# EasyEDA Pro project Flags_Register.eprj

# Schematic Schematic1
Board Name: Board1; Create Date: 2025-08-16; Page Name: P1; Project Name: Flags_Register; Schematic Name: Schematic1; Update Date: 2025-08-16; Company: EasyEDA.com; Page Size: A4; Version: V1.0
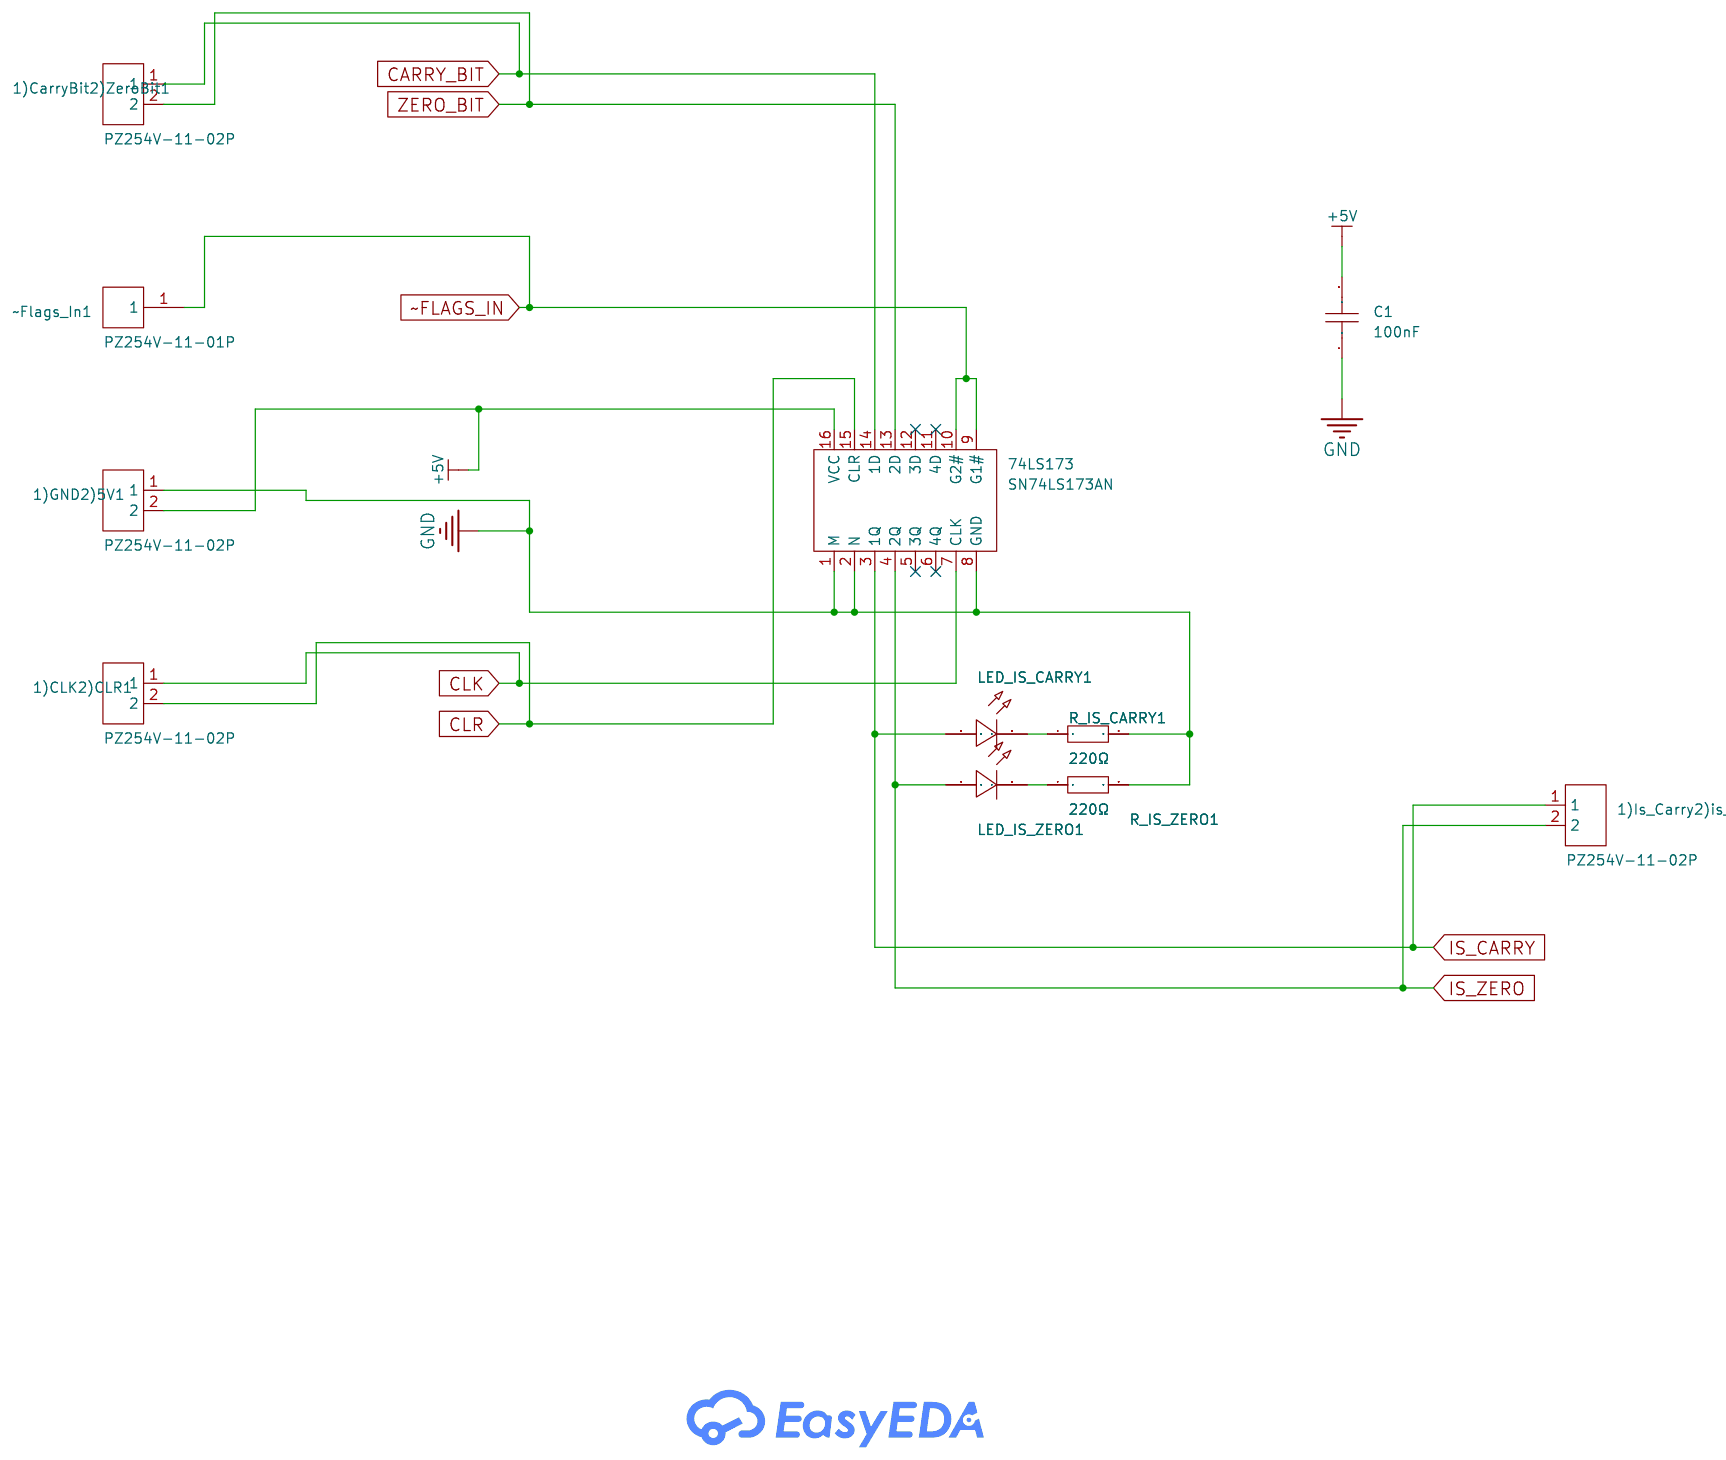
[diagram p0: schematic sheet]

## Parts
1)CarryBit2)ZeroBit1  PZ254V-11-02P  [HDR-TH_2P-P2.54-V-M]
1)CLK2)CLR1  PZ254V-11-02P  [HDR-TH_2P-P2.54-V-M]
1)GND2)5V1  PZ254V-11-02P  [HDR-TH_2P-P2.54-V-M]
1)Is_Carry2)is_Zero1  PZ254V-11-02P  [HDR-TH_2P-P2.54-V-M]
74LS173  SN74LS173AN  [PDIP-16_L19.3-W6.4-P2.54-LS7.94-BL]
C1  100nF  [CAP-TH_L8.5-W5.0-P5.00-D1.2]
LED_IS_CARRY1  -  [LED-TH_BD5.8-P2.54-FD]
LED_IS_ZERO1  -  [LED-TH_BD5.8-P2.54-FD]
R_IS_CARRY1  220Ω  [R_AXIAL-0.4]
R_IS_ZERO1  220Ω  [R_AXIAL-0.4]
~Flags_In1  PZ254V-11-01P  [HDR-TH_1P-P2.54-V-M]

## Library data of the parts
1)CarryBit2)ZeroBit1 1)CLK2)CLR1 1)GND2)5V1 1)Is_Carry2)is_Zero1 = PZ254V-11-02P: Pin Structure:1x2P Pitch:2.54mm Row Spacing:- Circluar Pins/Square Pins:Policy Mounting Type:Straight Number of Rows:Single Row Number of Pins:2P Current Rating:- Voltage Rating (Max):- Length of Mating Pin:6mm Insulation Height:2.5mm Length of End Connec; LCSC Part Name: 1x2P 间距:2.54mm 方针 直插; Supplier Part: C492401; Manufacturer: XFCN(兴飞); Supplier Footprint: 插件,P=2.54mm; JLCPCB Part Class: Extended Part; Datasheet: https://atta.szlcsc.com/upload/public/pdf/source/20200309/C492401_A812433581A9B211A7FFA413ADDFF0E5.pdf; Supplier: LCSC; Pin Structure: 1x2P; Pitch: 2.54mm; Circluar Pins/Square Pins: Policy; Mounting Type: Straight; Number of Rows: Single Row; Number of Pins: 2P; Length of Mating Pin: 6mm; Insulation Height: 2.5mm; Length of End Connection Pin: 3mm; Contact Material: Brass; Operating Temperature: -40℃~+105℃; Color: Black
74LS173 = SN74LS173AN: Type:D-Type Trigger Type:Rising Edge Voltage - Supply:4.75V~5.25V Voltage - Supply:4.75V~5.25V Clock Frequency:50MHz Function:Reset Number of Elements:1 Number of Bits per Element:4 Output Type:- Propagation Delay:30ns@5V,45pF Series:74LS Series Current -; Supplier Part: C1550125; Manufacturer: TI(德州仪器); Supplier Footprint: PDIP-16; JLCPCB Part Class: Extended Part; Datasheet: https://www.ti.com/cn/lit/gpn/sn74ls173a; Supplier: LCSC; Type: D-Type; Trigger Type: Rising Edge; Voltage - Supply: 4.75V~5.25V; Clock Frequency: 50MHz; Function: Reset; Number of Elements: 1; Number of Bits per Element: 4; Propagation Delay: 30ns@5V,45pF; Series: 74LS Series; Current - Output Low(IOL): 24mA; Current - Output High(IOH): 2.6mA; Quiescent Current: 24mA; Operating Temperature: 0℃~+70℃
C1 = CT4-0805B104K500F3: Capacitance:100nF Tolerance:±10% Tolerance:±10% Voltage Rated: Temperature Coefficient:; LCSC Part Name: 100nF ±10% 50V C3型（直脚）; Supplier Part: C84772; Manufacturer: FH(风华); Supplier Footprint: 插件,P=5.08mm; JLCPCB Part Class: Extended Part; Datasheet: https://atta.szlcsc.com/upload/public/pdf/source/20190402/C385200_059806A6312B28FF1421A2413EB641E1.pdf; Supplier: LCSC; Tolerance: ±10%
LED_IS_CARRY1 LED_IS_ZERO1 = LED_TH-R_5mm: Supplier Footprint: Through
R_IS_CARRY1 R_IS_ZERO1 = Res_AXIAL-1/4W: Supplier Footprint: Through
~Flags_In1 = PZ254V-11-01P: Pin Structure:1x1P Pitch:2.54mm Row Spacing:- Circluar Pins/Square Pins:Policy Mounting Type:Straight Number of Rows:Single Row Number of Pins:1P Current Rating:- Voltage Rating (Max):- Length of Mating Pin:6mm Insulation Height:2.5mm Length of End Connec; LCSC Part Name: 1x1P 间距:2.54mm 方针 直插; Supplier Part: C492400; Manufacturer: XFCN(兴飞); Supplier Footprint: 插件,P=2.54mm; JLCPCB Part Class: Extended Part; Datasheet: https://atta.szlcsc.com/upload/public/pdf/source/20200309/C492400_46876A5B545F5AE6B8D4A09C46E276E8.pdf; Supplier: LCSC; Pin Structure: 1x1P; Pitch: 2.54mm; Circluar Pins/Square Pins: Policy; Mounting Type: Straight; Number of Rows: Single Row; Number of Pins: 1P; Length of Mating Pin: 6mm; Insulation Height: 2.5mm; Length of End Connection Pin: 3mm; Contact Material: Brass; Operating Temperature: -40℃~+105℃; Color: Black

## Nets
+5V: 1)GND2)5V1.2 74LS173.16(VCC) C1.2
GND: 1)GND2)5V1.1 74LS173.1(M) 74LS173.2(N) 74LS173.8(GND) C1.1 R_IS_CARRY1.2 R_IS_ZERO1.2
CARRY_BIT: 1)CarryBit2)ZeroBit1.1 74LS173.14(1D)
CLK: 1)CLK2)CLR1.1 74LS173.7(CLK)
CLR: 1)CLK2)CLR1.2 74LS173.15(CLR)
IS_CARRY: 1)Is_Carry2)is_Zero1.1 74LS173.3(1Q) LED_IS_CARRY1.1(C)
IS_ZERO: 1)Is_Carry2)is_Zero1.2 74LS173.4(2Q) LED_IS_ZERO1.1(C)
ZERO_BIT: 1)CarryBit2)ZeroBit1.2 74LS173.13(2D)
~FLAGS_IN: 74LS173.9(G1#) 74LS173.10(G2#) ~Flags_In1.1
Net-(LED_IS_CARRY1-2): LED_IS_CARRY1.2(A) R_IS_CARRY1.1
Net-(LED_IS_ZERO1-2): LED_IS_ZERO1.2(A) R_IS_ZERO1.1

Not connected (* = marked no-connect by the designer): 74LS173 5(3Q)* 6(4Q)* 11(4D)* 12(3D)*

# Board PCB1
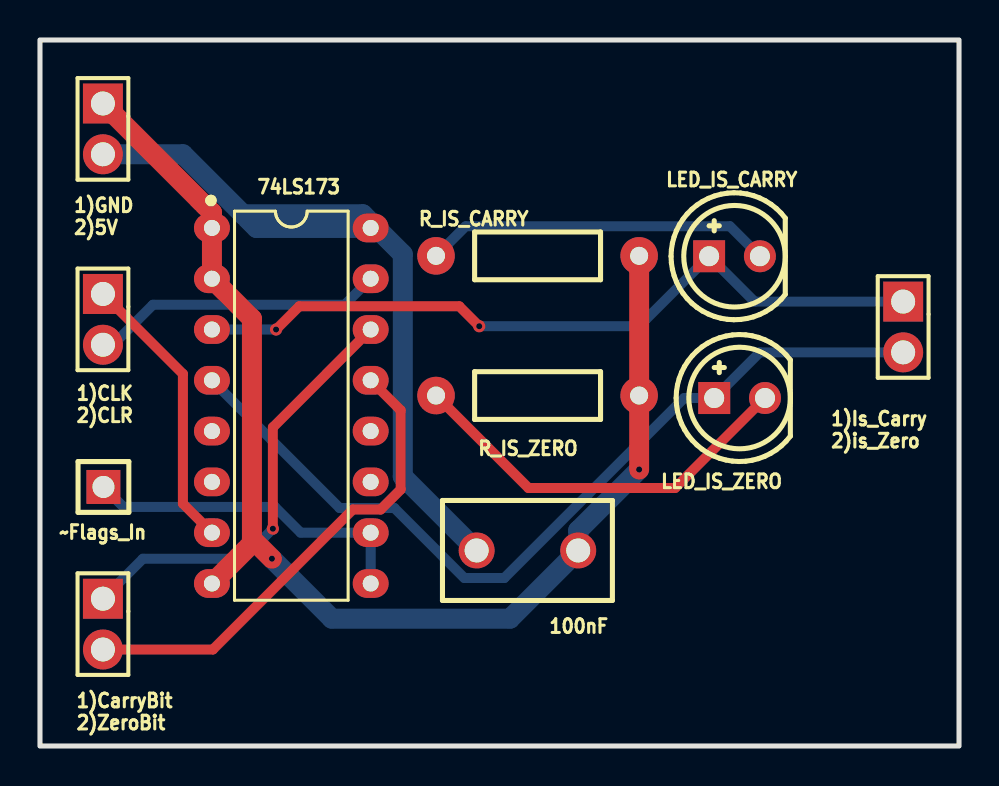
[diagram p1: board, top side]
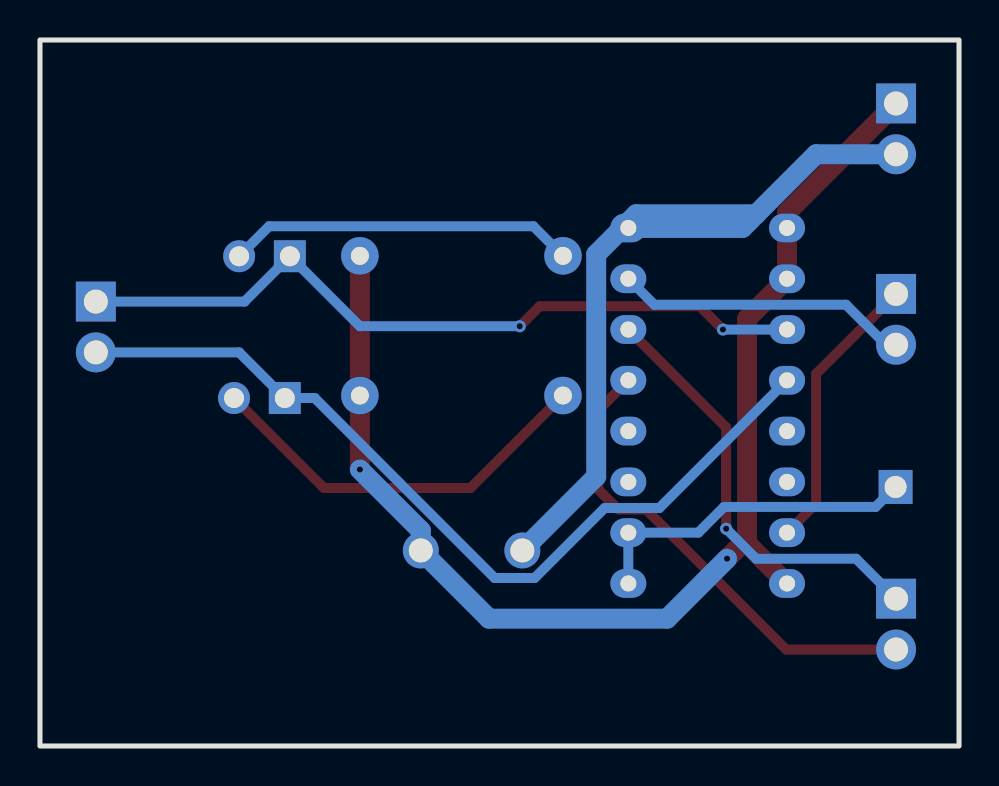
[diagram p2: board, bottom side, seen from below]

Outline 45.97 x 35.31 mm; copper layers: Top Layer, Bottom Layer. Coordinates in mm from the lower left corner of the outline.
Outline path: rectangle 0,35.31 45.97,0
Stack: Top Layer 0.035mm / Dielectric1 1.51mm FR4 er 4.5 / Bottom Layer 0.035mm

## Design rules (mm)
template: Custom Config
spacing copperThickness1oz (default): track to track 0.102, other pairs 0.152 to 0.3
spacing copperThickness2oz: track to track 0.203, other pairs 0.152 to 0.3
track width copperThickness1oz (default): min 0.127, default 0.5, max 2.54
track width copperThickness2oz: min 0.203, default 1, max 2.54
differential pair differentialPair (default): width min 0.127, default 0.254, max 2.54; gap min 0.152, default 0.152
via viaSize (default): diameter min 0.5, default 0.61, max 10; hole min 0.3, default 0.305, max 6.3
net GND uses copperThickness2oz
net +5V uses copperThickness2oz

## Placement (name value [footprint] x y rotation side)
1)CarryBit
2)ZeroBit  -  [HDR-TH_2P-P2.54-V-M]  3.15 6.1 270 top
1)CLK
2)CLR  -  [HDR-TH_2P-P2.54-V-M]  3.15 21.34 270 top
1)GND
2)5V  -  [HDR-TH_2P-P2.54-V-M]  3.15 30.86 270 top
1)Is_Carry
2)is_Zero  -  [HDR-TH_2P-P2.54-V-M]  43.18 20.95 270 top
74LS173  SN74LS173AN  [PDIP-16_L19.3-W6.4-P2.54-LS7.94-BL]  12.57 17.02 270 top
100nF  -  [CAP-TH_L8.5-W5.0-P5.00-D1.2]  24.38 9.78 180 top
LED_IS_CARRY  -  [LED-TH_BD5.8-P2.54-FD]  34.74 24.49 0 top
LED_IS_ZERO  -  [LED-TH_BD5.8-P2.54-FD]  35 17.4 0 top
R_IS_CARRY  -  [R_AXIAL-0.4]  24.89 24.51 0 top
R_IS_ZERO  -  [R_AXIAL-0.4]  24.89 17.53 0 top
~Flags_In  -  [HDR-TH_1P-P2.54-V-M]  3.18 12.95 0 top

## Footprints (pads in the part's own frame, mm; a bottom-side part is the same pattern mirrored in y, then rotated)
CAP-TH_L8.5-W5.0-P5.00-D1.2
  round 1.8 hole 1.2: 1(-2.54,0) 2(2.54,0)
HDR-TH_1P-P2.54-V-M
  rect 1.7x1.7 hole 1.1: 1(0,0)
HDR-TH_2P-P2.54-V-M
  rect 2x2 hole 1.2: 1(-1.27,0)
  round 2 hole 1.2: 2(1.27,0)
LED-TH_BD5.8-P2.54-FD
  rect 1.6x1.6 hole 1: 1(-1.27,0)
  round 1.6 hole 1: 2(1.27,0)
PDIP-16_L19.3-W6.4-P2.54-LS7.94-BL
  oval 1.44x1.8 hole 0.8: 1(-8.89,-3.97) 2(-6.35,-3.97) 3(-3.81,-3.97) 4(-1.27,-3.97) 5(1.27,-3.97) 6(3.81,-3.97) 7(6.35,-3.97) 8(8.89,-3.97) 9(8.89,3.97) 10(6.35,3.97) 11(3.81,3.97) 12(1.27,3.97) 13(-1.27,3.97) 14(-3.81,3.97) 15(-6.35,3.97) 16(-8.89,3.97)
R_AXIAL-0.4
  round 1.879 hole 0.899: 1(-5.08,0) 2(5.08,0)

## Nets
+5V: 1)GND
2)5V.2 74LS173.16 100nF.2
GND: 1)GND
2)5V.1 74LS173.1 74LS173.2 74LS173.8 100nF.1 R_IS_CARRY.2 R_IS_ZERO.2
CARRY_BIT: 1)CarryBit
2)ZeroBit.1 74LS173.14
CLK: 1)CLK
2)CLR.1 74LS173.7
CLR: 1)CLK
2)CLR.2 74LS173.15
IS_CARRY: 1)Is_Carry
2)is_Zero.1 74LS173.3 LED_IS_CARRY.1
IS_ZERO: 1)Is_Carry
2)is_Zero.2 74LS173.4 LED_IS_ZERO.1
ZERO_BIT: 1)CarryBit
2)ZeroBit.2 74LS173.13
~FLAGS_IN: 74LS173.9 74LS173.10 ~Flags_In.1
$1N628: LED_IS_CARRY.2 R_IS_CARRY.1
$1N629: LED_IS_ZERO.2 R_IS_ZERO.1

Pads without a net: 74LS173 5 6 11 12

## Via types
v1: diameter 0.61, hole 0.305, Top Layer to Bottom Layer, 5 vias

## Routing (per net, layer and track width the routed paths; a pad name or vN(x,y) marks a point on that pad's centre or on a via; arc(x,y) is an arc through that point)
+5V: length 40.1
  Bottom Layer w1: 10.15,26.59 7.15,29.59 1)GND
2)5V.2 ; 10.15,26.59 10.83,25.91 74LS173.16 ; 10.15,26.59 16.15,26.59 18.15,24.59 18.15,13.47 100nF.2
GND: length 63.3
  Top Layer w1: R_IS_CARRY.2 R_IS_ZERO.2 v1(29.97,13.83) ; 1)GND
2)5V.1 8.6,26.68 74LS173.1 74LS173.2 10.6,21.37 10.6,10.37 ; 74LS173.8 10.6,10.13 10.6,10.37 ; 10.6,10.37 v1(11.6,9.37)
  Bottom Layer w1: v1(29.97,13.83) 26.92,10.78 100nF.1 23.51,6.37 14.6,6.37 v1(11.6,9.37)
CARRY_BIT: length 21.9
  Top Layer w0.5: v1(11.65,10.87) 11.65,15.93 74LS173.14
  Bottom Layer w0.5: 1)CarryBit
2)ZeroBit.1 5.15,9.37 10.15,9.37 v1(11.65,10.87)
CLK: length 14.2
  Top Layer w0.5: 1)CLK
2)CLR.1 7.15,18.61 7.15,12.12 74LS173.7
CLR: length 14.8
  Bottom Layer w0.5: 1)CLK
2)CLR.2 3.65,20.07 5.65,22.07 15.24,22.07 74LS173.15
IS_CARRY: length 37.9
  Top Layer w0.5: v1(21.97,20.99) 20.97,21.99 12.97,21.99 v1(11.81,20.83)
  Bottom Layer w0.5: v1(11.81,20.83) 74LS173.3 ; v1(21.97,20.99) 29.97,20.99 LED_IS_CARRY.1 35.74,22.23 1)Is_Carry
2)is_Zero.1
IS_ZERO: length 43.3
  Bottom Layer w0.5: 74LS173.4 14.99,11.9 17.73,11.9 21.23,8.4 23.23,8.4 32.23,17.4 LED_IS_ZERO.1 36.01,19.69 1)Is_Carry
2)is_Zero.2
ZERO_BIT: length 24.3
  Top Layer w0.5: 74LS173.13 18.04,16.79 18.04,12.83 17.04,11.83 15.65,11.83 8.65,4.83 1)CarryBit
2)ZeroBit.2
~FLAGS_IN: length 16.9
  Bottom Layer w0.5: ~Flags_In.1 4.18,11.95 11.76,11.95 13.04,10.67 74LS173.10 74LS173.9
$1N628: length 17.4
  Bottom Layer w0.5: R_IS_CARRY.1 21.29,25.99 34.51,25.99 LED_IS_CARRY.2
$1N629: length 20.2
  Top Layer w0.5: R_IS_ZERO.1 24.44,12.9 31.77,12.9 LED_IS_ZERO.2
